# EAGLE design 1U_attenuvert (EAGLE 9.5.1)
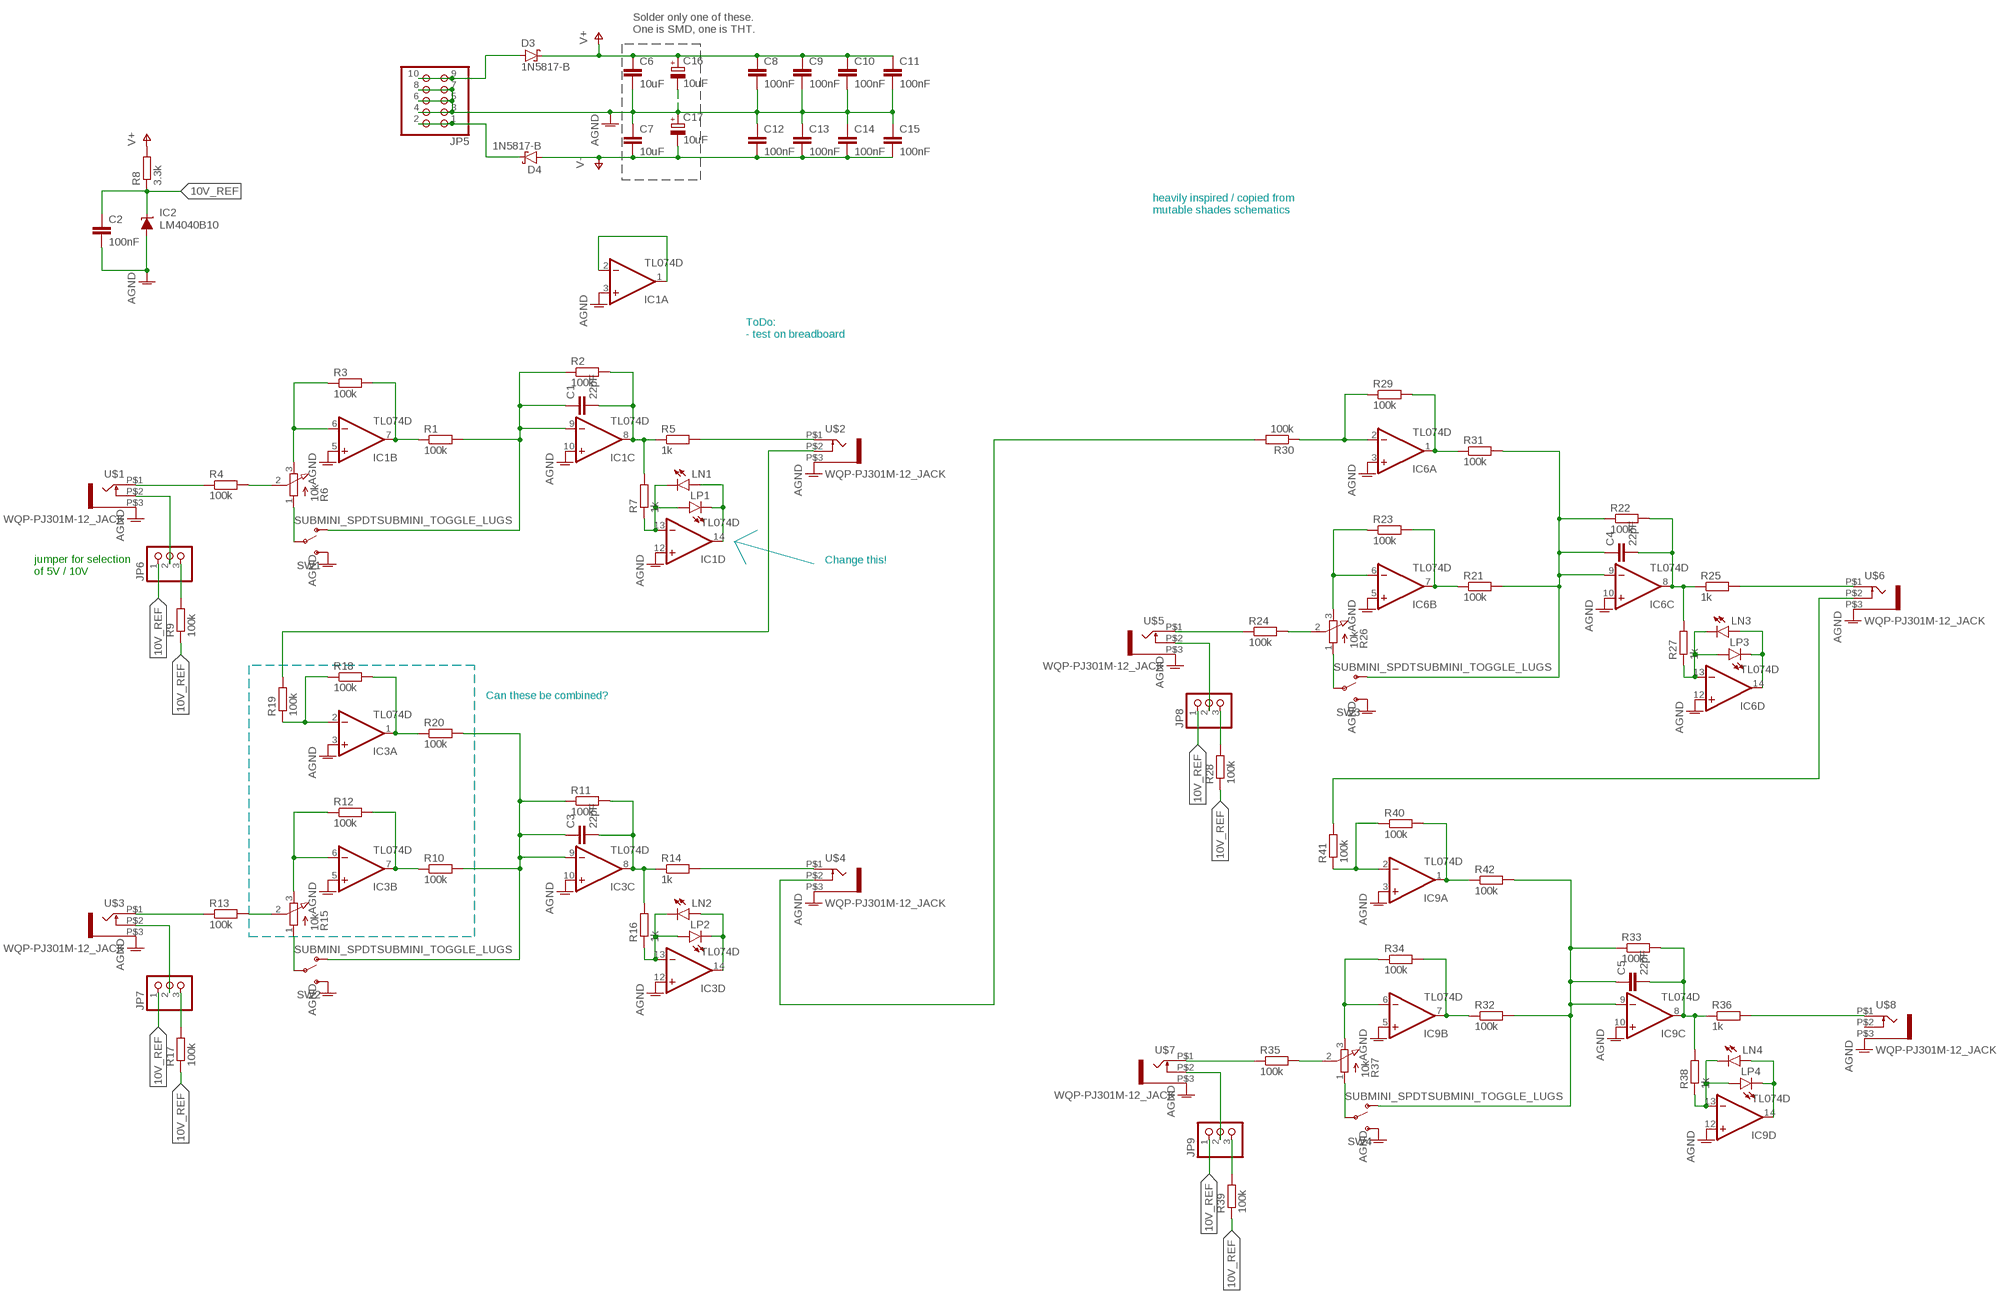
[diagram p0: schematic, sheet 1]

## Parts
C1  22pF  C-EUC0603  [C0603]
C2  100nF  C-EUC0603  [C0603]
C3  22pF  C-EUC0603  [C0603]
C4  22pF  C-EUC0603  [C0603]
C5  22pF  C-EUC0603  [C0603]
C6  10uF  C-EUC0805  [C0805]
C7  10uF  C-EUC0805  [C0805]
C8  100nF  C-EUC0603  [C0603]
C9  100nF  C-EUC0603  [C0603]
C10  100nF  C-EUC0603  [C0603]
C11  100nF  C-EUC0603  [C0603]
C12  100nF  C-EUC0603  [C0603]
C13  100nF  C-EUC0603  [C0603]
C14  100nF  C-EUC0603  [C0603]
C15  100nF  C-EUC0603  [C0603]
C16  10uF  CPOL-EUE2.5-6  [E2,5-6]
C17  10uF  CPOL-EUE2.5-6  [E2,5-6]
D3  1N5817-B  [DO41-7.6]
D4  1N5817-B  [DO41-7.6]
IC1  TL074D  [SO14]
IC2  LM4040B10  LM4041A12DBZ  [DBZ_R-PDSO-G3]
IC3  TL074D  [SO14]
IC6  TL074D  [SO14]
IC9  TL074D  [SO14]
JP5  PINHD-2X5  [2X05]
JP6  PINHD-1X3  [1X03]
JP7  PINHD-1X3  [1X03]
JP8  PINHD-1X3  [1X03]
JP9  PINHD-1X3  [1X03]
LN1  LED3MM  [LED3MM]
LN2  LED3MM  [LED3MM]
LN3  LED3MM  [LED3MM]
LN4  LED3MM  [LED3MM]
LP1  LED3MM  [LED3MM]
LP2  LED3MM  [LED3MM]
LP3  LED3MM  [LED3MM]
LP4  LED3MM  [LED3MM]
R1  100k  R-EU_R0603  [R0603]
R2  100k  R-EU_R0603  [R0603]
R3  100k  R-EU_R0603  [R0603]
R4  100k  R-EU_R0603  [R0603]
R5  1k  R-EU_R0603  [R0603]
R6  10k  EVUF2L  [EVUFXL]
R7  1k  R-EU_R0603  [R0603]
R8  3.3k  R-EU_R0603  [R0603]
R9  100k  R-EU_R0603  [R0603]
R10  100k  R-EU_R0603  [R0603]
R11  100k  R-EU_R0603  [R0603]
R12  100k  R-EU_R0603  [R0603]
R13  100k  R-EU_R0603  [R0603]
R14  1k  R-EU_R0603  [R0603]
R15  10k  EVUF2L  [EVUFXL]
R16  1k  R-EU_R0603  [R0603]
R17  100k  R-EU_R0603  [R0603]
R18  100k  R-EU_R0603  [R0603]
R19  100k  R-EU_R0603  [R0603]
R20  100k  R-EU_R0603  [R0603]
R21  100k  R-EU_R0603  [R0603]
R22  100k  R-EU_R0603  [R0603]
R23  100k  R-EU_R0603  [R0603]
R24  100k  R-EU_R0603  [R0603]
R25  1k  R-EU_R0603  [R0603]
R26  10k  EVUF2L  [EVUFXL]
R27  1k  R-EU_R0603  [R0603]
R28  100k  R-EU_R0603  [R0603]
R29  100k  R-EU_R0603  [R0603]
R30  100k  R-EU_R0603  [R0603]
R31  100k  R-EU_R0603  [R0603]
R32  100k  R-EU_R0603  [R0603]
R33  100k  R-EU_R0603  [R0603]
R34  100k  R-EU_R0603  [R0603]
R35  100k  R-EU_R0603  [R0603]
R36  1k  R-EU_R0603  [R0603]
R37  10k  EVUF2L  [EVUFXL]
R38  1k  R-EU_R0603  [R0603]
R39  100k  R-EU_R0603  [R0603]
R40  100k  R-EU_R0603  [R0603]
R41  100k  R-EU_R0603  [R0603]
R42  100k  R-EU_R0603  [R0603]
SW1  SUBMINI_SPDTSUBMINI_TOGGLE_LUGS  [SUBMINI_TOGGLE_LUGS]
SW2  SUBMINI_SPDTSUBMINI_TOGGLE_LUGS  [SUBMINI_TOGGLE_LUGS]
SW3  SUBMINI_SPDTSUBMINI_TOGGLE_LUGS  [SUBMINI_TOGGLE_LUGS]
SW4  SUBMINI_SPDTSUBMINI_TOGGLE_LUGS  [SUBMINI_TOGGLE_LUGS]
U$1  WQP-PJ301M-12_JACK  [WQP-PJ301M-12_JACK]
U$2  WQP-PJ301M-12_JACK  [WQP-PJ301M-12_JACK]
U$3  WQP-PJ301M-12_JACK  [WQP-PJ301M-12_JACK]
U$4  WQP-PJ301M-12_JACK  [WQP-PJ301M-12_JACK]
U$5  WQP-PJ301M-12_JACK  [WQP-PJ301M-12_JACK]
U$6  WQP-PJ301M-12_JACK  [WQP-PJ301M-12_JACK]
U$7  WQP-PJ301M-12_JACK  [WQP-PJ301M-12_JACK]
U$8  WQP-PJ301M-12_JACK  [WQP-PJ301M-12_JACK]

## Nets
10V_REF [signal]: C2.1 IC2.1(C) JP6.1 JP7.1 JP8.1 JP9.1 R8.1 R9.1 R17.1 R28.1 R39.1
AGND [GND]: C2.2 C6.2 C7.1 C8.2 C9.2 C10.2 C11.2 C12.1 C13.1 C14.1 C15.1 C16.- C17.+ IC1.3(A:+IN) IC1.5(B:+IN) IC1.10(C:+IN) IC1.12(D:+IN) IC2.2(A) IC3.3(A:+IN) IC3.5(B:+IN) IC3.10(C:+IN) IC3.12(D:+IN) IC6.3(A:+IN) IC6.5(B:+IN) IC6.10(C:+IN) IC6.12(D:+IN) IC9.3(A:+IN) IC9.5(B:+IN) IC9.10(C:+IN) IC9.12(D:+IN) JP5.3 JP5.4 JP5.5 JP5.6 JP5.7 JP5.8 SW1.3(S) SW2.3(S) SW3.3(S) SW4.3(S) U$1.P$3 U$2.P$3 U$3.P$3 U$4.P$3 U$5.P$3 U$6.P$3 U$7.P$3 U$8.P$3
N$1 [signal]: C1.1 IC1.9(C:-IN) R1.2 R2.1 SW1.1(O)
N$2 [signal]: R4.2 R6.2(S)
N$3 [signal]: IC1.7(B:OUT) R1.1 R3.2
N$4 [signal]: IC1.6(B:-IN) R3.1 R6.3(E)
N$5 [signal]: C1.2 IC1.8(C:OUT) R2.2 R5.1 R7.2
N$6 [signal]: R5.2 U$2.P$1
N$7 [signal]: R6.1(A) SW1.COM(COMMON)
N$8 [signal]: IC1.13(D:-IN) LN1.K(C) LP1.A R7.1
N$9 [signal]: R4.1 U$1.P$1
N$10 [signal]: IC1.14(D:OUT) LN1.A LP1.K(C)
N$11 [signal]: JP6.2 U$1.P$2
N$12 [signal]: C3.1 IC3.9(C:-IN) R10.2 R11.1 R20.2 SW2.1(O)
N$13 [signal]: JP6.3 R9.2
N$14 [signal]: IC3.7(B:OUT) R10.1 R12.2
N$15 [signal]: IC3.6(B:-IN) R12.1 R15.3(E)
N$16 [signal]: C3.2 IC3.8(C:OUT) R11.2 R14.1 R16.2
N$17 [signal]: R14.2 U$4.P$1
N$18 [signal]: R13.2 R15.2(S)
N$19 [signal]: R15.1(A) SW2.COM(COMMON)
N$20 [signal]: IC3.13(D:-IN) LN2.K(C) LP2.A R16.1
N$21 [signal]: IC3.14(D:OUT) LN2.A LP2.K(C)
N$22 [signal]: R13.1 U$3.P$1
N$23 [signal]: JP7.2 U$3.P$2
N$24 [signal]: JP7.3 R17.2
N$25 [signal]: R19.2 U$2.P$2
N$26 [signal]: IC3.2(A:-IN) R18.1 R19.1
N$27 [signal]: IC3.1(A:OUT) R18.2 R20.1
N$28 [signal]: C4.1 IC6.9(C:-IN) R21.2 R22.1 R31.2 SW3.1(O)
N$29 [signal]: IC6.7(B:OUT) R21.1 R23.2
N$30 [signal]: IC6.6(B:-IN) R23.1 R26.3(E)
N$31 [signal]: C4.2 IC6.8(C:OUT) R22.2 R25.1 R27.2
N$32 [signal]: R25.2 U$6.P$1
N$33 [signal]: R24.2 R26.2(S)
N$34 [signal]: R26.1(A) SW3.COM(COMMON)
N$35 [signal]: IC6.13(D:-IN) LN3.K(C) LP3.A R27.1
N$36 [signal]: IC6.14(D:OUT) LN3.A LP3.K(C)
N$37 [signal]: R24.1 U$5.P$1
N$38 [signal]: JP8.2 U$5.P$2
N$39 [signal]: JP8.3 R28.2
N$40 [signal]: R30.2 U$4.P$2
N$41 [signal]: IC6.2(A:-IN) R29.1 R30.1
N$42 [signal]: IC6.1(A:OUT) R29.2 R31.1
N$43 [signal]: C5.1 IC9.9(C:-IN) R32.2 R33.1 R42.2 SW4.1(O)
N$44 [signal]: IC9.7(B:OUT) R32.1 R34.2
N$45 [signal]: IC9.6(B:-IN) R34.1 R37.3(E)
N$46 [signal]: C5.2 IC9.8(C:OUT) R33.2 R36.1 R38.2
N$47 [signal]: R36.2 U$8.P$1
N$48 [signal]: R35.2 R37.2(S)
N$49 [signal]: R37.1(A) SW4.COM(COMMON)
N$50 [signal]: IC9.13(D:-IN) LN4.K(C) LP4.A R38.1
N$51 [signal]: IC9.14(D:OUT) LN4.A LP4.K(C)
N$52 [signal]: R35.1 U$7.P$1
N$53 [signal]: JP9.2 U$7.P$2
N$54 [signal]: JP9.3 R39.2
N$55 [signal]: R41.2 U$6.P$2
N$56 [signal]: IC9.2(A:-IN) R40.1 R41.1
N$57 [signal]: IC9.1(A:OUT) R40.2 R42.1
N$58 [signal]: IC1.1(A:OUT) IC1.2(A:-IN)
N$61 [power]: D4.C JP5.1 JP5.2
N$62 [power]: D3.A JP5.9 JP5.10
V+ [power]: C6.1 C8.1 C9.1 C10.1 C11.1 C16.+ D3.C R8.2
V- [power]: C7.2 C12.2 C13.2 C14.2 C15.2 C17.- D4.A
Unconnected: U$8.P$2

## Notes on the sheet
- Solder only one of these.
  One is SMD, one is THT.
- heavily inspired / copied from
  mutable shades schematics
- ToDo:
  - test on breadboard
- Change this!
- jumper for selection
  of 5V / 10V
- Can these be combined?

## Power pins joined to a net without a drawn wire
V+: IC1.4(P:V+) IC3.4(P:V+) IC6.4(P:V+) IC9.4(P:V+)
V-: IC1.11(P:V-) IC3.11(P:V-) IC6.11(P:V-) IC9.11(P:V-)

## Library data of the parts
C1-C15 = rcl:C-EU: CAPACITOR, European symbol; SPICEPREFIX: C
C16 C17 = rcl:CPOL-EU: POLARIZED CAPACITOR, European symbol; SPICEPREFIX: C
D3 D4 = diode:1N581*: 1.0A SCHOTTKY BARRIER RECTIFIER Source: http://www.diodes.com/datasheets/ds23001.pdf
IC1 IC3 IC6 IC9 = linear:TL074: OP AMP
IC2 = texas:LM4041: PRECISION MICROPOWER SHUNT VOLTAGE REFERENCE Source: http://focus.ti.com/lit/ds/slcs146e/slcs146e.pdf; MPN: LM4041A12IDBZR; OC_FARNELL: 1407949; OC_NEWARK: 58K5875
JP5 = pinhead:PINHD-2X5: PIN HEADER
JP6-JP9 = pinhead:PINHD-1X3: PIN HEADER
LN1-LN4 LP1-LP4 = led:LED: LED OSRAM: - CHIPLED LG R971, LG N971, LY N971, LG Q971, LY Q971, LO R971, LY R971 LH N974, LH R974 LS Q976, LO Q976, LY Q976 LO Q996 - Hyper CHIPLED LW Q18S LB Q993, LB Q99A, LB R99A - SideLED LS A670, LO A670, LY A670, LG A670, LP A670 LB A673, LV A673, LT A673, LW A673 LH A674 LY A675 LS A676, LA A676, LO A676, LY A676, LW A676 LS A679, LY A679, LG A679 - Hyper Micro SIDELED® LS Y876, LA Y876, LO Y876, LY Y876 LT Y87S - SmartLED LW L88C, LW L88S LB L89C, LB L89S, LG L890 LS L89K, LO L89K, LY L89K LS L896, LA L896, LO L896, LY L896 - TOPLED LS T670, LO T670, LY T670, LG T670, LP T670 LSG T670, LSP T670, LSY T670, LOP T670, LYG T670 LG T671, LOG T671, LSG T671 LB T673, LV T673, LT T673, LW T673 LH T674 LS T676, LA T676, LO T676, LY T676, LB T676, LH T676, LSB T676, LW T676 LB T67C, LV T67C, LT T67C, LS T67K, LO T67K, LY T67K, LW E67C LS E67B, LA E67B, LO E67B, LY E67B, LB E67C, LV E67C, LT E67C LW T67C LS T679, LY T679, LG T679 LS T770, LO T770, LY T770, LG T770, LP T770 LB T773, LV T773, LT T773, LW T773 LH T774 LS E675, LA E675, LY E675, LS T675 LS T776, LA T776, LO T776, LY T776, LB T776 LHGB T686 LT T68C, LB T68C - Hyper Mini TOPLED® LB M676 - Mini TOPLED Santana® LG M470 LS M47K, LO M47K, LY M47K Source: http://www.osram.convergy.de LUXEON: - LUMILED® LXK2-PW12-R00, LXK2-PW12-S00, LXK2-PW14-U00, LXK2-PW14-V00 LXK2-PM12-R00, LXK2-PM12-S00, LXK2-PM14-U00 LXK2-PE12-Q00, LXK2-PE12-R00, LXK2-PE12-S00, LXK2-PE14-T00, LXK2-PE14-U00 LXK2-PB12-K00, LXK2-PB12-L00, LXK2-PB12-M00, LXK2-PB14-N00, LXK2-PB14-P00, LXK2-PB14-Q00 LXK2-PR12-L00, LXK2-PR12-M00, LXK2-PR14-Q00, LXK2-PR14-R00 LXK2-PD12-Q00, LXK2-PD12-R00, LXK2-PD12-S00 LXK2-PH12-R00, LXK2-PH12-S00 LXK2-PL12-P00, LXK2-PL12-Q00, LXK2-PL12-R00 Source: www.luxeon.com KINGBRIGHT: KA-3528ASYC Source: www.kingbright.com
R1-R5 R7-R14 R16-R25 R27-R36 R38-R42 = rcl:R-EU_: RESISTOR, European symbol; SPICEPREFIX: R
R6 R15 R26 R37 = pot_EVU_no_holes:EVU: 9 mm Square Rotary Potentiometers Source: Panasonic
SW1-SW4 = MusicThingModular:SUBMINI_SPDT
U$1-U$8 = thonkiconn:WQP-PJ301M-12_JACK

## Net classes
1 signal: width 0.254 mm, clearance 0.254 mm
2 power: width 0.508 mm, clearance 0.508 mm to class 1, clearance 0.508 mm
3 GND: width 0.635 mm, clearance 0.508 mm to class 1, clearance 0.508 mm to class 2, clearance 0.508 mm

## Board
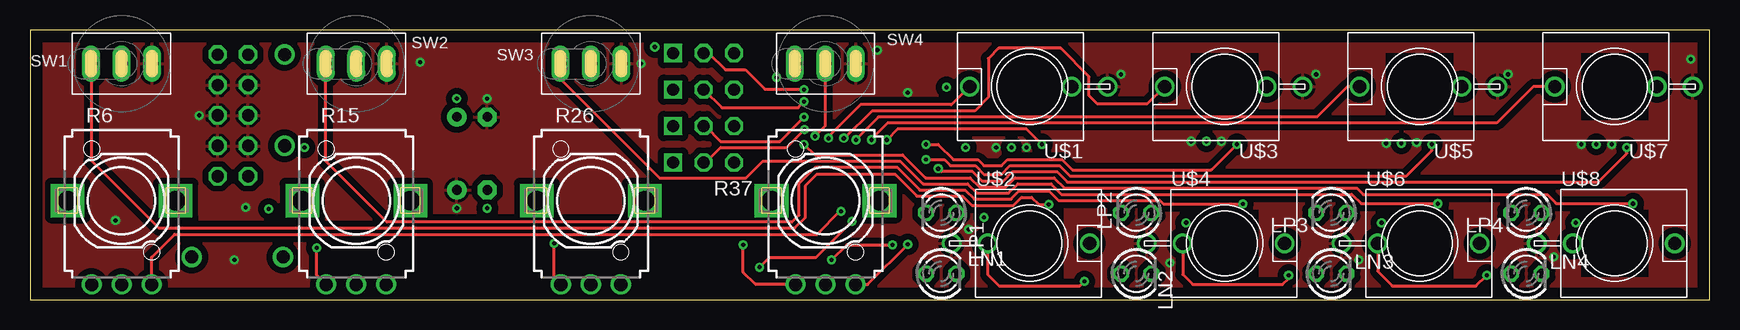
[diagram p1: board, top side]
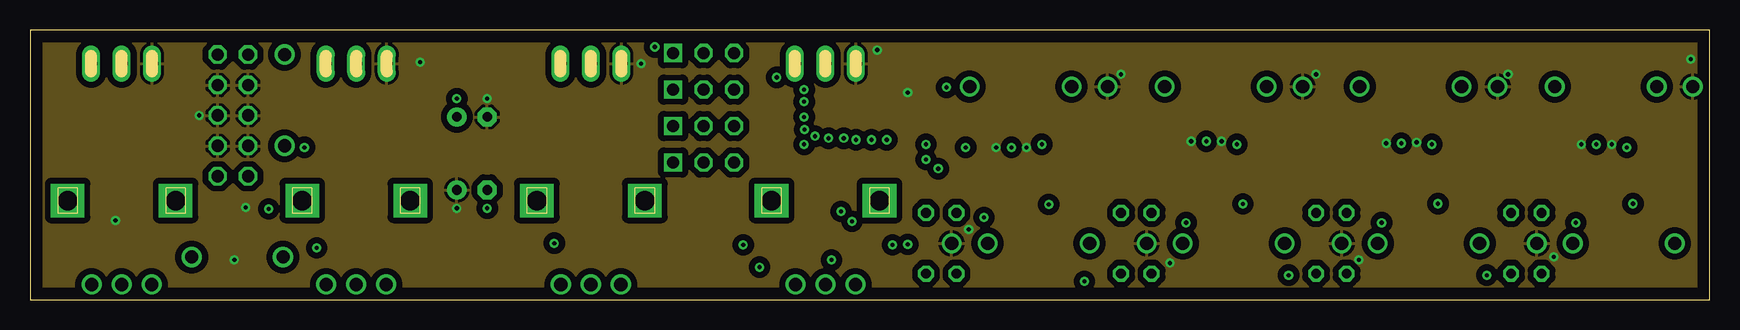
[diagram p2: board, inner layer Route2]
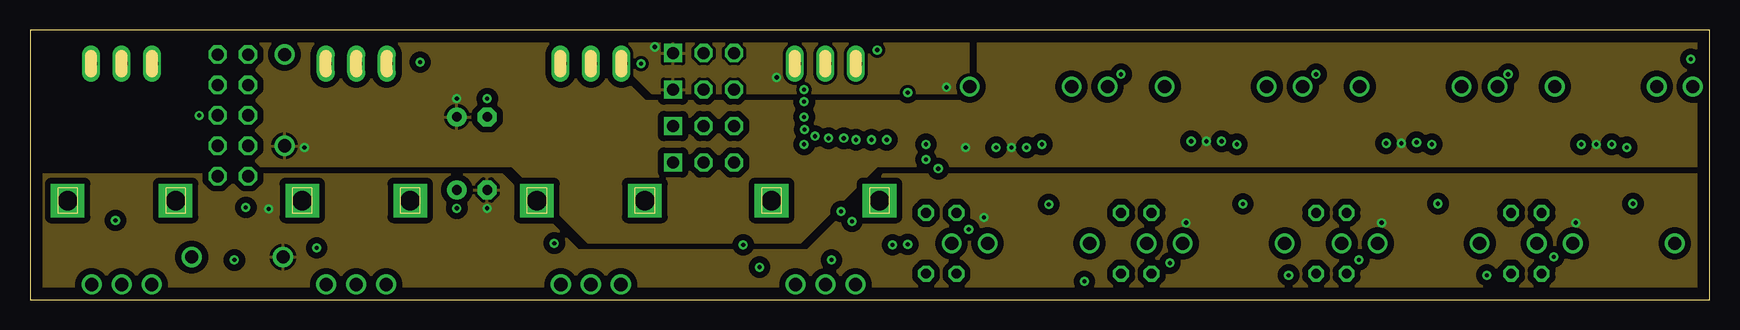
[diagram p3: board, inner layer Route15]
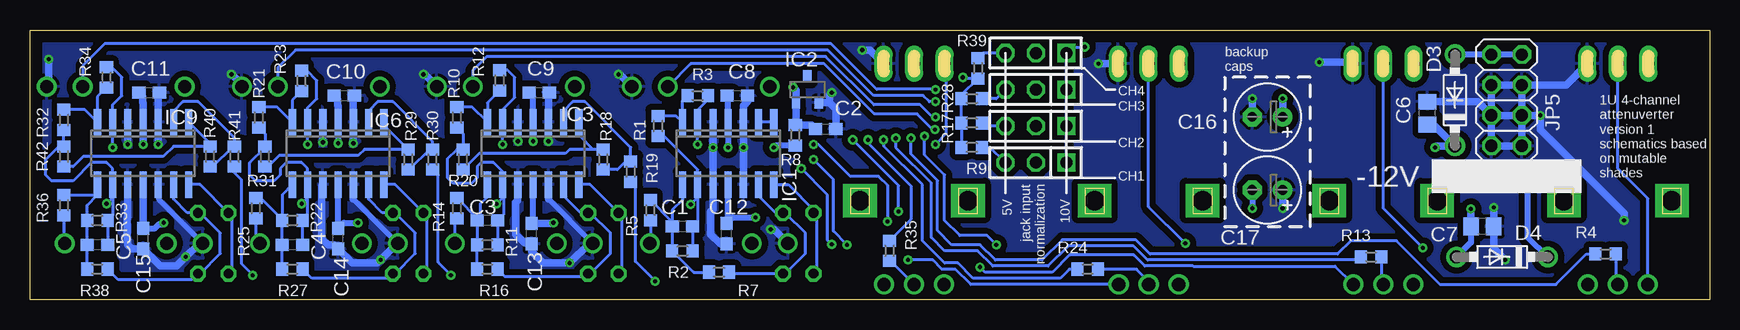
[diagram p4: board, bottom side, seen from below]

Size 140 x 22.5 mm. Coordinates in mm from the lower left corner, seen from the top.
Outline: 0,0 140,0 140,22.5 0,22.5 0,0
Copper layers (1+2*15+16): Top 0.035mm / dielectric 1.5mm / Route2 0.035mm / dielectric 0.15mm / Route15 0.035mm / dielectric 0.2mm / Bottom 0.035mm
Design rules "default *": minimum track width 6mil, minimum drill 0.35mm, track to track 6mil, track to pad 6mil, pad to pad 6mil, via to via 6mil, smd to smd 6mil, copper to edge 40mil, drill to drill 6mil, minimum pad ring 10mil, minimum via ring 8mil, stop-mask expansion 4mil, vias tented up to drill 0mil, thermal gap 10mil

### Footprints (pad centres in the part's own frame; a part is rotated, then mirrored left to right if it is on the bottom)
C0603 = smd 1.1 x 1: 1 -0.85,0; 2 0.85,0
C0805 = smd 1.3 x 1.5: 1 -0.95,0; 2 0.95,0
E2,5-6 = drill 0.813 pad 1.6: + -1.27,0 | drill 0.813 pad 1.6 octagon: - 1.27,0
DO41-7.6 = drill 1.1 pad 1.7: A 3.81,0; C -3.81,0
SO14 = smd 0.6 x 2.2: 1 -3.81,-2.6; 2 -2.54,-2.6; 3 -1.27,-2.6; 4 0,-2.6; 5 1.27,-2.6; 6 2.54,-2.6; 7 3.81,-2.6; 8 3.81,2.6; 9 2.54,2.6; 10 1.27,2.6; 11 0,2.6; 12 -1.27,2.6; 13 -2.54,2.6; 14 -3.81,2.6
DBZ_R-PDSO-G3 = smd 0.7 x 1: 1 -0.95,-1.1; 2 0.95,-1.1; 3 0,1.1
2X05 = drill 1.016 octagon: 1 -5.08,-1.27; 2 -5.08,1.27; 3 -2.54,-1.27; 4 -2.54,1.27; 5 0,-1.27; 6 0,1.27; 7 2.54,-1.27; 8 2.54,1.27; 9 5.08,-1.27; 10 5.08,1.27
1X03 = drill 1.016 square: 1 -2.54,0 | drill 1.016 octagon: 2 0,0; 3 2.54,0
LED3MM = drill 0.813 octagon: A -1.27,0; K 1.27,0
R0603 = smd 1 x 1.1: 1 -0.85,0; 2 0.85,0
EVUFXL = drill 1.1 pad 1.676: 1 -2.5,-7; 2 0,-7; 3 2.5,-7 | drill 1.6 pad 2.8 square: M1 4.5,0; M2 -4.5,0
SUBMINI_TOGGLE_LUGS = drill 1 pad 1.422 long: 1 -2.54,0; 3 2.54,0; COM 0,0
WQP-PJ301M-12_JACK = drill 1.1: P$1 0,5; P$2 0,-3.5; P$3 0,-6.5

### Placement (x,y rotation side)
C1  85.61,6.1 180 bottom
C2  73.68,14.22 0 bottom
C3  101.87,6.6 180 bottom
C4  118.13,4.57 180 bottom
C5  134.38,4.57 180 bottom
C6  23.51,15.55 90 bottom
C7  18.94,6.1 180 bottom
C8  81.04,17.02 0 bottom
C9  97.55,17.27 0 bottom
C10  113.81,17.02 0 bottom
C11  130.06,17.27 0 bottom
C12  81.93,5.5 90 bottom
C13  98.19,5.5 90 bottom
C14  114.32,5.08 90 bottom
C15  130.57,5.08 90 bottom
C16  36.85,15.24 180 bottom
C17  36.85,9.14 180 bottom
D3  21.23,16.64 90 bottom
D4  17.29,3.56 180 bottom
IC1  81.8,12.19 180 bottom
IC2  75.2,17.53 0 bottom
IC3  98.06,12.19 180 bottom
IC6  114.32,12.19 180 bottom
IC9  130.57,12.19 180 bottom
JP5  16.91,15.37 90 bottom
JP6  56.15,11.43 180 bottom
JP7  56.15,14.48 180 bottom
JP8  56.15,17.53 180 bottom
JP9  56.15,20.57 180 bottom
LN1  75.96,2.16 0 top
LN2  92.22,2.16 0 top
LN3  108.47,2.16 0 top
LN4  124.73,2.16 0 top
LP1  75.96,7.24 180 top
LP2  92.22,7.24 180 top
LP3  108.47,7.24 180 top
LP4  124.73,7.24 180 top
R1  87.65,14.48 270 bottom
R2  85.61,4.06 180 bottom
R3  84.34,17.02 180 bottom
R4  8.65,3.81 0 bottom
R5  88.28,7.45 270 bottom
R6  7.64,8.26 0 top
R7  82.57,2.29 180 bottom
R8  76.22,13.72 270 bottom
R9  61.48,12.7 0 bottom
R10  104.41,15.2 270 bottom
R11  101.87,4.57 180 bottom
R12  100.85,18.29 270 bottom
R13  28.21,3.56 0 bottom
R14  104.41,7.62 270 bottom
R15  27.19,8.26 0 top
R16  101.87,2.54 180 bottom
R17  61.48,14.73 0 bottom
R18  92.22,11.68 90 bottom
R19  89.93,10.67 270 bottom
R20  103.9,11.68 90 bottom
R21  120.92,15.2 270 bottom
R22  118.13,6.6 180 bottom
R23  117.36,18.25 270 bottom
R24  51.83,2.54 0 bottom
R25  121.17,7.62 270 bottom
R26  46.75,8.26 0 top
R27  118.13,2.54 180 bottom
R28  61.48,16.76 0 bottom
R29  108.47,11.68 90 bottom
R30  106.44,11.68 270 bottom
R31  120.41,11.94 90 bottom
R32  137.18,14.99 270 bottom
R33  134.38,6.6 180 bottom
R34  133.62,18.54 270 bottom
R35  68.34,4.06 270 bottom
R36  137.18,7.87 270 bottom
R37  66.31,8.26 0 top
R38  134.38,2.54 180 bottom
R39  60.98,19.3 90 bottom
R40  124.98,11.94 90 bottom
R41  122.95,11.94 270 bottom
R42  137.18,11.94 90 bottom
SW1  7.64,19.68 0 top
SW2  27.19,19.68 0 top
SW3  46.75,19.68 0 top
SW4  66.31,19.68 0 top
U$1  83.33,17.78 90 top
U$2  83.33,4.7 270 top
U$3  99.58,17.78 90 top
U$4  99.58,4.7 270 top
U$5  115.84,17.78 90 top
U$6  115.84,4.7 270 top
U$7  132.1,17.78 90 top
U$8  132.1,4.7 270 top

### Tracks (layer width: path | path; a pad name or v marks a point on that pad's centre or on a via)
10V_REF  (via drill 0.35)
  Bottom 0.254: JP6.1 JP7.1 JP8.1 JP9.1 53.1,21.08 v52.09,21.08 | R9.1 R17.1 R28.1 62.33,17.1 R39.1 62.16,18.45 v62.25,18.54
  Bottom 0.635: C2.1 74.87,14.57 R8.1 76.15,14.63 IC2.1 76.15,17.46 v76.4,17.71
  pour Route15: 47.01,22.1 51.83,17.27 77.49,17.27 78.25,18.03 78.25,22.1
AGND  (via drill 0.35)
  Bottom 0.406: IC9.12 129.3,8.4 U$8.P$3 | U$4.P$3 96.79,8.4 | 113.05,8.4 U$6.P$3
  Bottom 0.635: U$2.P$3 77.97,5.84 v78.25,5.84 | C8.2 80.19,16.51 80.53,16.17 IC1.3 v80.53,12.7 IC1.12 | C9.2 96.79,17.18 IC3.3 v96.79,13.21 | C12.1 82.45,4.65 83.26,5.46 83.26,7.34 83.07,7.52 IC1.10 v83.07,12.7 IC1.5 | C10.2 113.05,16.93 IC6.3 v113.05,13.04 | 115.68,5.08 115.7,5.08 | 115.68,5.08 115.16,4.55 114.64,4.55 C14.1 113.13,3.05 111.04,3.05 v110.77,3.32 109.39,4.7 U$6.P$3 | IC6.10 115.68,9.49 115.68,5.08 | C11.2 129.3,17.18 IC9.3 v129.3,12.95 | IC9.5 v131.84,12.95 | C15.1 130.64,4.3 | C15.1 131.5,4.23 131.84,4.57 131.84,4.98 131.9,5.04 131.9,6.82 131.84,6.88 IC9.10 | JP5.7 JP5.8 JP5.6 | JP5.7 JP5.5 | JP5.5 JP5.3 JP5.4 JP5.6 | JP5.6 JP5.5 | v17.99,7.69 C7.1 17.99,4.26 v17.03,3.3 | SW1.3 11.95,17.91 JP5.7 | JP5.5 v14.11,15.37 14.11,14.2 7.12,7.2 7.12,6.62 v7.13,6.6 | C6.2 19.32,16.5 JP5.6 | SW3.3 v50.94,19.68 | SW4.3 69.99,20.83 v70.63,20.83 | SW2.3 29.86,19.81 v32.53,19.81 | C17.+ v35.58,7.62 | C16.- v38.12,16.76 | C2.2 72.83,15.91 73.34,16.43 | IC3.10 99.35,9.57 99.35,8.28 99.51,8.11 99.51,5.46 98.78,4.72 98.26,4.72 C13.1 98.19,4 97.23,3.05 v95.01,3.05 93.36,4.7 U$4.P$3 | 96.79,8.4 IC3.12 | U$1.P$3 90.84,18.8 v90.95,18.8 | U$3.P$3 107.1,18.8 v107.2,18.8 | U$5.P$3 122.34,17.93 v123.21,18.8 | U$7.P$3 138.45,17.93 v138.45,20.07 | IC6.5 v115.59,13.12 | 113.05,8.4 IC6.12 | C15.1 129.14,2.79 127.78,2.79 v127.02,3.56 125.87,4.7 U$8.P$3 | 73.34,16.43 IC2.2 | 73.34,16.43 73.34,17.1 v73.17,17.27 | IC3.5 v99.33,13.21
  pour Route2: -1.64,22.86 -1.64,-0.13 141.88,-0.13 141.88,22.86
  pour Bottom: -1.25,22.61 -1.25,-0.25 141.24,-0.25 141.24,22.61
  pour Top: -1.25,22.61 -1.25,-0.25 141.24,-0.25 141.24,22.61
N$1  (via drill 0.35)
  Top 0.254: SW1.1 5.1,11.62 10.75,5.97 63.75,5.97 64.61,6.83 64.61,9.48 65.56,10.42 72.14,10.42 73.93,8.64 77.74,8.64 78.5,7.87 81.99,7.87 82.65,8.53 83.49,8.53 84.09,7.94 v84.92,7.94
  Bottom 0.254: 84.34,8.52 IC1.9 84.34,10.83 87.14,13.63 R1.2 | 84.34,8.52 84.34,6.52 C1.1 R2.1 | v84.92,7.94 84.34,8.52
N$2
  Bottom 0.254: R4.2 7.8,1.42 R6.2
N$3
  Bottom 0.254: R1.1 86.15,15.33 IC1.7 85.61,16.6 R3.2
N$4  (via drill 0.35)
  Top 0.254: v67.6,7.35 67.5,7.35 65.61,5.46 12.05,5.46 10.14,3.54 R6.3 | v84.34,12.95 83.08,14.22 72.31,14.22 v71.42,13.33
  Bottom 0.254: R3.1 83.49,16.67 84.34,15.82 IC1.6 v84.34,12.95 | v71.42,13.33 67.6,9.52 v67.6,7.35
N$5
  Bottom 0.254: C1.2 R2.2 84.69,2.29 R7.2 | C1.2 86.46,6.49 R5.1 | C1.2 86.46,7.47 85.61,8.32 IC1.8
N$6
  Bottom 0.254: R5.2 88.28,4.75 U$2.P$1
N$7
  Bottom 0.254: R6.1 5.14,8.42 7.64,10.92 SW1.COM
N$8
  Bottom 0.254: IC1.13 79.26,8.64 77.87,7.24 LP1.A 77.05,7.24 75.37,5.56 75.37,3.84 77.05,2.16 LN1.K 81.72,2.16 R7.1
N$9  (via drill 0.35)
  Top 0.254: U$1.P$1 76.8,16.25 69.22,16.25 66.56,13.6 v66.56,13.46
  Bottom 0.254: v66.56,13.46 66.56,12.15 64.35,9.94 64.35,5.75 63.17,4.57 60.81,4.57 59.54,3.3 55.64,3.3 53.95,5 47.83,5 46.64,3.81 31,3.81 29.91,4.9 26.1,4.9 22.47,1.27 12.8,1.27 10.26,3.81 R4.1
N$10
  Bottom 0.254: IC1.14 76.79,9.59 74.69,7.49 LP1.K 74.44,6.99 74.44,2.41 LN1.A
N$11  (via drill 0.35)
  Top 0.254: JP6.2 56.31,11.43 57.58,12.7 63.07,12.7 v64.56,14.2
  Bottom 0.254: U$1.P$2 84.92,19.68 73.81,19.68 69.62,15.49 66.06,15.49 64.76,14.2 v64.56,14.2
N$12  (via drill 0.35)
  Top 0.254: SW2.1 24.65,11.56 29.74,6.47 63.52,6.47 64.1,7.06 64.1,9.69 65.47,11.05 72.28,11.05 74.18,9.14 77.95,9.14 78.71,8.38 81.78,8.38 82.44,9.04 84.95,9.04 85.72,8.28 94.17,8.28 94.47,7.99 v101.11,7.99
  Bottom 0.254: 100.52,8.58 100.52,9.51 IC3.9 100.6,10.67 101.36,11.43 102.38,11.43 102.72,11.09 102.72,10.18 103.19,9.7 104.71,9.7 105.17,10.16 105.17,11.77 104.41,12.53 R20.2 103.9,13.84 R10.2 | 100.52,8.58 100.52,7.11 C3.1 R11.1 | v101.11,7.99 100.52,8.58
N$13
  Bottom 0.254: JP6.3 59.96,12.7 R9.2
N$14
  Bottom 0.254: R12.2 101.87,16.42 IC3.7 103.13,16.05 R10.1
N$15  (via drill 0.35)
  Top 0.254: v68.52,6.53 65.48,3.49 61.6,3.49 v60.81,2.71 | v100.6,12.95 98.47,10.82 86.9,10.82 86.03,11.68 81.49,11.68 80.98,11.18 79.51,11.18 79,11.68 76.98,11.68 75.71,12.95 v74.69,12.95
  Bottom 0.254: R12.1 100.18,19.14 99.59,18.54 99.59,16.86 100.6,15.85 IC3.6 v100.6,12.95 | R15.3 31.22,2.78 43.04,2.78 43.05,2.79 47.06,2.79 47.99,3.73 53.34,3.73 54.78,2.29 60.39,2.29 v60.81,2.71 | v68.52,6.53 68.52,9.56 69.25,10.29 71.61,10.29 74.27,12.95 v74.69,12.95
N$16
  Bottom 0.254: C3.2 R11.2 R16.2 | R14.1 102.72,6.78 C3.2 | IC3.8 101.87,8.58 102.47,7.98 102.47,6.86 C3.2
N$17
  Bottom 0.254: R14.2 104.58,6.6 U$4.P$1
N$18
  Bottom 0.254: R13.2 27.36,1.42 R15.2
N$19  (via drill 0.35)
  Top 0.254: R15.1 23.89,2.06 v23.89,4.32
  Bottom 0.254: v23.89,4.32 27.19,7.62 SW2.COM
N$20
  Bottom 0.254: R16.1 100.39,1.91 93.74,1.91 LN2.K 93.31,2.16 91.62,3.84 91.62,5.56 93.31,7.24 LP2.A 94.12,7.24 95.52,8.64 IC3.13
N$21
  Bottom 0.254: IC3.14 93.3,9.59 LP2.K 90.69,6.99 90.69,2.41 LN2.A
N$22  (via drill 0.35)
  Top 0.254: v67.83,13.46 67.91,13.46 70.19,15.74 78.76,15.74 79.89,16.88 79.89,20.12 80.73,20.96 85.93,20.96 88.29,18.6 88.29,17 88.97,16.32 93.12,16.32 U$3.P$1
  Bottom 0.254: v67.83,13.46 67.83,12.7 64.86,9.73 64.86,5.17 63.75,4.06 61.02,4.06 59.75,2.79 55.13,2.79 53.44,4.49 48.04,4.49 46.85,3.3 29.31,3.3 R13.1
N$23  (via drill 0.35)
  Top 0.254: JP7.2 56.31,14.48 57.58,13.21 62.5,13.21 v64.53,15.24
  Bottom 0.254: U$3.P$2 103.08,19.11 101.92,20.27 73.68,20.27 69.66,16.26 65.8,16.26 64.79,15.24 v64.53,15.24
N$24
  Bottom 0.254: JP7.3 60.38,14.48 R17.2
N$25  (via drill 0.35)
  Top 0.254: U$2.P$2 79.83,2.1 80.79,1.14 87.52,1.14 v87.9,1.52
  Bottom 0.254: v87.9,1.52 87.9,1.55 89.53,3.18 89.53,9.42 R19.2
N$26
  Bottom 0.254: R18.1 91.04,10.83 90.35,11.52 R19.1 89.93,12.7 93.74,16.51 94.76,16.51 95.52,15.75 IC3.2
N$27
  Bottom 0.254: R18.2 93.07,12.53 | 93.07,12.53 94.25,13.72 IC3.1 | 93.07,12.53 95.02,12.53 95.36,12.19 102.54,12.19 R20.1
N$28  (via drill 0.35)
  Top 0.254: SW3.1 44.21,18.41 52.47,10.16 59.71,10.16 61.1,11.56 72.53,11.56 74.44,9.65 78.16,9.65 78.92,8.89 81.57,8.89 82.33,9.65 85.11,9.65 85.97,8.79 110.17,8.79 110.96,8 v117.36,8
  Bottom 0.254: 116.86,8.51 116.86,7.02 R22.1 C4.1 | 116.86,8.51 IC6.9 116.86,10.92 117.36,11.43 118.63,11.43 119.14,10.92 119.14,10.41 119.65,9.91 121.17,9.91 121.68,10.41 121.68,11.43 120.41,12.7 R31.2 120.41,13.84 R21.2 | v117.36,8 116.86,8.51
N$29
  Bottom 0.254: R23.2 118.13,16.64 IC6.7 119.39,16.05 R21.1
N$30  (via drill 0.35)
  Top 0.254: v116.86,12.95 116.86,12.45 114.72,10.31 86.69,10.31 85.82,11.18 81.7,11.18 80.96,10.43 79.54,10.43 78.79,11.18 76.72,11.18 76.22,11.68 v74.69,11.68 | v66.82,3.3 68.09,4.57 v71.9,4.57
  Bottom 0.254: R23.1 116.91,19.1 116.09,18.29 116.09,16.76 116.86,16 IC6.6 v116.86,12.95 | R26.3 61.58,1.25 62.86,2.54 63.98,2.54 64.74,3.3 v66.82,3.3 | v71.9,4.57 73.04,5.71 73.04,10.03 v74.69,11.68
N$31
  Bottom 0.254: R27.2 C4.2 R22.2 | R22.2 118.98,6.69 120.75,8.47 R25.1 | IC6.8 118.98,8.74 R22.2
N$32
  Bottom 0.254: R25.2 121.17,5.03 U$6.P$1
N$33
  Bottom 0.254: R26.2 46.75,1.52 47.77,2.54 R24.2
N$34  (via drill 0.35)
  Top 0.254: R26.1 43.7,1.8 v43.7,4.7
  Bottom 0.254: v43.7,4.7 46.75,7.75 SW3.COM
N$35
  Bottom 0.254: R27.1 116.51,1.78 110.12,1.78 LN3.K 109.56,2.16 107.88,3.84 107.88,5.56 109.56,7.24 LP3.A 110.63,7.24 111.78,8.38 IC6.13
N$36
  Bottom 0.254: IC6.14 109.56,9.59 LP3.K 106.95,6.99 106.95,2.41 LN3.A
N$37  (via drill 0.35)
  Top 0.254: U$5.P$1 109.82,17.78 107.28,15.24 70.73,15.24 68.85,13.36 v68.85,13.33
  Bottom 0.254: v68.85,13.33 68.85,12.82 65.62,9.6 65.62,4.9 63.77,3.05 62.65,3.05 61.38,1.78 54.12,1.78 53.36,2.54 R24.1
N$38  (via drill 0.35)
  Top 0.254: JP8.2 57.67,16.01 64.03,16.01 v64.53,16.51
  Bottom 0.254: U$5.P$2 119.34,19.36 117.87,20.83 73.48,20.83 69.68,17.02 65.55,17.02 65.03,16.51 v64.53,16.51
N$39
  Bottom 0.254: JP8.3 59.45,16.76 R28.2
N$40  (via drill 0.35)
  Top 0.254: U$4.P$2 96.08,2.1 96.92,1.27 104.41,1.27 104.92,1.78 v104.92,2.03
  Bottom 0.254: v104.92,2.03 104.92,2.06 105.98,3.12 105.98,10.37 R30.2
N$41
  Bottom 0.254: R29.1 108.34,10.97 108.26,10.97 106.7,12.53 R30.1 106.44,13.21 109.74,16.51 111.01,16.51 111.78,15.75 IC6.2
N$42
  Bottom 0.254: IC6.1 110.51,14.57 R29.2 112.12,12.53 112.63,12.03 119.22,12.03 120.16,11.09 R31.1
N$43  (via drill 0.35)
  Top 0.254: v133.62,8 127.22,8 126.46,8.76 111.14,8.76 110.61,9.3 86.22,9.3 85.36,10.16 82.12,10.16 81.36,9.4 79.13,9.4 78.37,10.16 74.65,10.16 72.74,12.06 65.42,12.06 v64.53,12.95
  Bottom 0.254: C5.1 R33.1 133.11,7.02 133.11,8.51 | 133.11,8.51 IC9.9 133.11,10.92 133.62,11.43 134.89,11.43 136.41,9.91 138.19,9.91 138.7,10.41 138.7,11.68 137.43,12.95 137.18,12.95 | R42.2 137.18,12.95 | 137.18,12.95 R32.2 | SW4.1 63.64,19.56 63.64,13.84 v64.53,12.95 | v133.62,8 133.11,8.51
N$44
  Bottom 0.254: R34.2 134.38,16.93 IC9.7 135.43,15.84 R32.1
N$45  (via drill 0.35)
  Top 0.254: R37.3 69.83,1.25 v73.17,4.6 | v75.71,10.92 75.96,10.67 78.58,10.67 79.34,9.91 81.15,9.91 81.91,10.67 85.61,10.67 86.48,9.8 130.72,9.8 133.11,12.19 v133.11,12.7
  Bottom 0.254: R34.1 133.2,19.39 132.35,18.54 132.35,17.02 133.11,16.26 IC9.6 v133.11,12.7 | v75.71,10.92 73.55,8.76 73.55,4.98 v73.17,4.6
N$46
  Bottom 0.254: R38.2 C5.2 R33.2 135.23,7.87 134.38,8.72 | R36.1 134.38,8.72 | 134.38,8.72 IC9.8
N$47
  Bottom 0.254: R36.2 137.18,4.78 U$8.P$1
N$48
  Bottom 0.254: R37.2 68.27,3.21 R35.2
N$49  (via drill 0.35)
  Top 0.254: R37.1 60.48,1.25 59.45,2.29 v59.45,4.57 | v65.43,13.63 66.31,14.52 SW4.COM
  Bottom 0.254: v59.45,4.57 60.21,5.33 62.5,5.33 63.77,6.6 63.77,10.41 65.43,12.07 v65.43,13.63
N$50
  Bottom 0.254: IC9.13 128.03,8.38 126.89,7.24 LP4.A 125.82,7.24 124.14,5.56 124.14,3.84 125.82,2.16 LN4.K 126.51,1.65 132.64,1.65 R38.1
N$51
  Bottom 0.254: IC9.14 125.81,9.59 LP4.K 123.21,6.99 123.21,2.41 LN4.A
N$52  (via drill 0.35)
  Top 0.254: v70.15,13.33 70.15,13.39 71.48,14.73 122.27,14.73 125.32,17.78 U$7.P$1
  Bottom 0.254: R35.1 66.56,6.69 66.56,9.49 70.15,13.08 v70.15,13.33
N$53  (via drill 0.35)
  Top 0.254: JP9.2 56.57,20.57 57.96,19.18 59.63,19.18 61.27,17.54 64.52,17.54 v64.53,17.53
  Bottom 0.254: v64.53,17.53 64.55,17.54 69.42,17.54 73.24,21.36 74.95,21.36 133.75,21.36 135.6,19.51 U$7.P$2
N$54
  Bottom 0.254: JP9.3 60.56,20.57 R39.2
N$55  (via drill 0.35)
  Top 0.254: U$6.P$2 112.34,2.36 113.55,1.14 120.54,1.14 v121.43,2.03
  Bottom 0.254: v121.43,2.03 121.43,2.06 122.36,2.99 122.36,9.99 122.95,10.58 R41.2
N$56
  Bottom 0.254: R40.1 124.78,11.09 123.08,12.79 R41.1 122.95,13.46 126,16.51 127.27,16.51 128.03,15.75 IC9.2
N$57
  Bottom 0.254: IC9.1 124.98,13.01 R40.2 128.03,12.79 128.88,11.94 135.56,11.94 136.41,11.09 R42.1
N$58
  Bottom 0.254: IC1.1 IC1.2
N$61
  Bottom 0.508: D4.C 15.13,5.21 15.13,9.78 JP5.1 JP5.2
N$62
  Bottom 0.508: JP5.9 JP5.10 D3.A
V+  (via drill 0.35)
  Bottom 0.508: IC1.4 81.85,14.84 | C9.1 98.06,16.93 IC3.4 v98.06,13.21 | IC1.4 81.8,16.93 C8.1 | IC1.4 v81.8,12.7 | IC6.4 v114.32,13.04 | R8.2 77.83,12.87 v77.99,12.7
  Bottom 0.635: IC6.4 114.32,16.16 114.33,16.18 114.33,16.69 C10.1 | C11.1 130.59,16.95 130.59,16.43 130.57,16.41 IC9.4 v130.57,12.95 | C6.1 23,14.61 D3.C 22.75,12.83 v22.88,12.7 | C16.+ v35.58,16.76
  pour Route15: -0.49,22.1 -0.49,11.18 40.15,11.18 46.5,4.83 64.28,4.83 70.63,11.18 140.73,11.18 140.73,22.1 79.01,22.1 79.01,17.53 77.99,16.51 51.32,16.51 45.74,22.1
V-  (via drill 0.35)
  Bottom 0.508: IC1.11 81.8,6.48 C12.2 81.42,6.86 v79.52,6.86 | C13.2 98.06,6.48 IC3.11 | 130.57,10.41 IC9.11 | IC6.11 C14.2 113.84,6.41 v112.67,6.41 | C7.2 19.89,4.76 D4.A | C17.- v38.12,7.62 | C15.2 129.61,5.93 129.25,6.29 128.97,6.29 v128.85,6.41
  Bottom 0.635: C12.2 81.74,6.16 | C15.2 IC9.11 | C7.2 v19.89,7.56 | C13.2 96.43,6.35 v96.37,6.41
  pour Route15: -0.49,10.41 -0.49,0.51 140.73,0.51 140.73,10.41 71.14,10.41 64.79,4.06 45.74,4.06 39.39,10.41

### Text on the board
bPlace: backup / caps | CH4 | CH3 | CH2 | 1U 4-channel / attenuverter / version 1 / schematics based / on mutable / shades | CH1 | jack input / normalization | -12V | 10V | 5V
ref-old: check LED resistor value